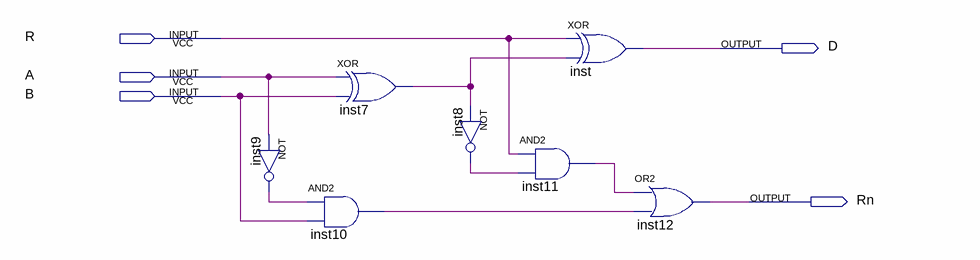
[diagram p0: schematic sheet]
// Quartus schematic Sub1Bit.bdf as structural Verilog: 7 symbols, 5 pins
module Sub1Bit (
  input  R,
  input  A,
  input  B,
  output D,
  output Rn
);

  wire inst7_out, inst8_out, inst9_out, inst10_out, inst11_out;

  not inst9 (inst9_out, A);
  and inst10 (inst10_out, inst9_out, B);
  xor inst7 (inst7_out, A, B);
  not inst8 (inst8_out, inst7_out);
  and inst11 (inst11_out, R, inst8_out);
  xor inst (D, R, inst7_out);
  or inst12 (Rn, inst11_out, inst10_out);
endmodule
